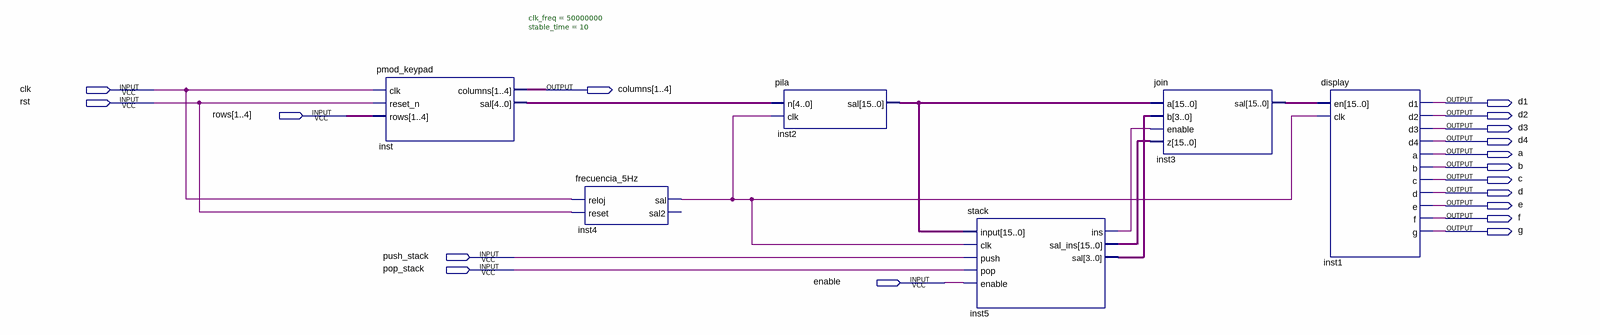
[diagram p0: schematic sheet]
// Quartus schematic teclado.bdf as structural Verilog: 6 symbols, 18 pins
module teclado (
  input  clk,
  input  rst,
  input  [1:4] rows,
  input  push_stack,
  input  pop_stack,
  input  enable,
  output [1:4] columns,
  output d1,
  output d2,
  output d3,
  output d4,
  output a,
  output b,
  output c,
  output d,
  output e,
  output f,
  output g
);

  wire inst4_sal, inst5_ins;
  wire [3:0] inst5_sal;
  wire [4:0] inst_sal;
  wire [15:0] inst2_sal, inst3_sal, inst5_sal_ins;

  pmod_keypad #(.clk_freq(50000000), .stable_time(10)) inst (
    .clk(clk), .reset_n(rst), .rows(rows), .columns(columns), .sal(inst_sal));
  frecuencia_5Hz inst4 (.reloj(clk), .reset(rst), .sal(inst4_sal));  // open: sal2
  pila inst2 (.n(inst_sal), .clk(inst4_sal), .sal(inst2_sal));
  stack inst5 (
    .\input (inst2_sal), .clk(inst4_sal), .push(push_stack), .pop(pop_stack), .enable(enable),
    .ins(inst5_ins), .sal_ins(inst5_sal_ins), .sal(inst5_sal));
  \join  inst3 (.a(inst2_sal), .b(inst5_sal), .enable(inst5_ins), .z(inst5_sal_ins), .sal(inst3_sal));
  display inst1 (
    .en(inst3_sal), .clk(inst4_sal), .d1(d1), .d2(d2), .d3(d3), .d4(d4), .a(a), .b(b), .c(c), .d(d), .e(e),
    .f(f), .g(g));
endmodule
